# Altium schematic sheet V1_0.SchDoc
size A4
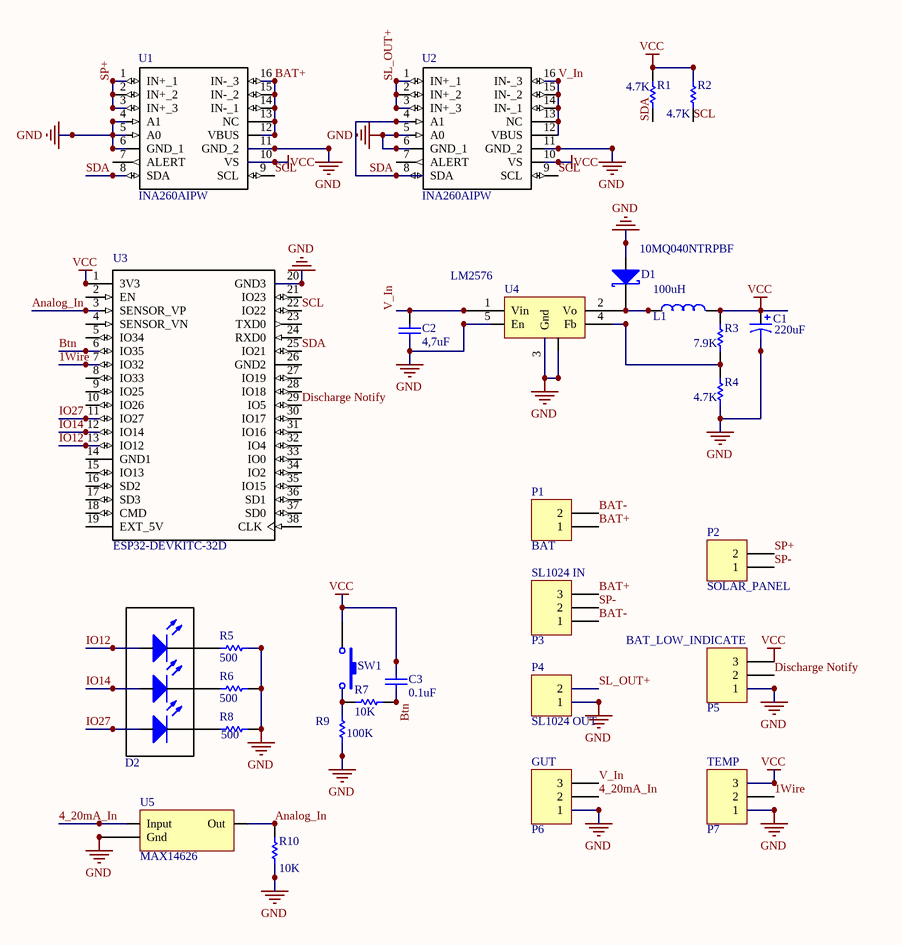
[diagram p0: V1_0.SchDoc]

## Parts
C1  value 220uF  [Capacitor -Tantalum E size SMD]  (hidden comment: Capacitor Tantalum)
C2  value 4,7uF  [CAPC3225L]  (hidden comment: Ceramic Capacitor)
C3  value 0.1uF  [CAP 0603]  (hidden comment: Capacitor)
D1  Name: 10MQ040NTRPBF  [DIOM4427X20N]  (hidden comment: Diode Schottky)
D2  RGB 5050  [LED 5050]  (value not drawn)
L1  value 100uH  [CDRH127]  (hidden comment: Coil)
P1  BAT  [DG301_2pin]
P2  SOLAR_PANEL  [DG301_2pin]
P3  SL1024 IN  [DG301_3pin]
P4  SL1024 OUT  [DG301_2pin]
P5  BAT_LOW_INDICATE  [DG301_3pin]
P6  GUT  [DG301_3pin]
P7  TEMP  [DG301_3pin]
R1  value 4.7K  [RES1608]
R2  value 4.7K  [RES1608]
R3  value 7.9K  [RES1608]
R4  value 4.7K  [RES1608]
R5  value 500  [RES1608]
R6  value 500  [RES1608]
R7  value 10K  [RES1608]
R8  value 500  [RES1608]
R9  value 100K  [RES1608]
R10  value 10K  [RESC3216L]  (hidden comment: Resistor)
SW1  SW-34  [SW-34]  (value not drawn)
U1  INA260AIPW  [SOP65P640X120-16N]
U2  INA260AIPW  [SOP65P640X120-16N]
U3  ESP32-DEVKITC-32D  [*MODULE_ESP32-DEVKITC-32D]
U4  PartNumber: LM2576  [TO170P1435X450-6N - duplicate]  (hidden comment: IC)
U5  MAX14626  [TDFN-6]

## Nets
GND: C1.1 C2.1 D1.2(A) P4.1 P5.1 P6.1 P7.1 R4.1 R5.1 R6.1 R8.1 R9.2 R10.1 U1.4(A1) U1.5(A0) U1.6(GND_1) U1.11(GND_2) U2.5(A0) U2.6(GND_1) U2.11(GND_2) U3.20(GND3) U4.3(Gnd) U4.5(En) U4.6(Gnd) U5.2(NC) U5.3(NC) U5.4(NC) U5.5(Gnd) U5.7(NC)
VCC: C1.2 C3.2 L1.1 P5.3 P7.3 R1.2 R2.2 R3.2 SW1.1 U1.10(VS) U2.10(VS) U3.1(3V3)
1Wire: P7.2 U3.7(IO32)
4_20mA_In: P6.2 U5.1(Input)
Analog_In: R10.2 U3.3(SENSOR_VP) U5.6(Out)
BAT+: P1.1 P3.3 U1.12(VBUS) U1.13(NC) U1.14(IN-_1) U1.15(IN-_2) U1.16(IN-_3)
BAT-: P1.2 P3.1
Btn: C3.1 R7.2 U3.6(IO35)
Discharge Notify: P5.2 U3.29(IO5)
IO12: D2.1 U3.13(IO12)
IO14: D2.2 U3.12(IO14)
IO27: D2.3 U3.11(IO27)
SCL: R2.1 U1.9(SCL) U2.9(SCL) U3.22(IO22)
SDA: R1.1 U1.8(SDA) U2.4(A1) U2.8(SDA) U3.25(IO21)
SL_OUT+: P4.2 U2.1(IN+_1) U2.2(IN+_2) U2.3(IN+_3)
SP+: P2.2 U1.1(IN+_1) U1.2(IN+_2) U1.3(IN+_3)
SP-: P2.1 P3.2
V_In: C2.2 P6.3 U2.12(VBUS) U2.13(NC) U2.14(IN-_1) U2.15(IN-_2) U2.16(IN-_3) U4.1(Vin)
NetD1_1: D1.1(K) L1.2 U4.2(Vo)
NetD2_4: D2.4 R5.2
NetD2_5: D2.5 R6.2
NetD2_6: D2.6 R8.2
NetR3_1: R3.1 R4.2 U4.4(Fb)
NetR7_1: R7.1 R9.1 SW1.2

Not connected (* = marked no-connect by the designer): U1 7(ALERT); U2 7(ALERT); U3 2(EN) 4(SENSOR_VN) 5(IO34) 8(IO33) 9(IO25) 10(IO26) 14(GND1) 15(IO13) 16(SD2) 17(SD3) 18(CMD) 19(EXT_5V) 21(IO23) 23(TXD0) 24(RXD0) 26(GND2) 27(IO19) 28(IO18) 30(IO17) 31(IO16) 32(IO4) 33(IO0) 34(IO2) 35(IO15) 36(SD1) 37(SD0) 38(CLK)

## Library data of the parts
C1 = Cap_tantal: Power/Voltage: 10V; Tolerance: +-10%; PackageDescription: SMD; PackageReference: Size-E
C2 = Cap Semi: Capacitor (Semiconductor SIM Model); Power/Voltage: 50V; Tolerance: +-10%; Published: 8-Jun-2000; LatestRevisionDate: 29-May-2009; LatestRevisionNote: IPC-7351 Footprint Added.; PackageReference: C1210; Publisher: Altium Limited; PackageDescription: SMD
D1 = Shotky_Diode: Manufacturer: International Rectifier; PackageDescription: SMA (DO-214AC); PartNumber: 10MQ040NTRPBF
L1 = Coil: Inductor; PartNumber: CDRH127/LD; Manufacturer: Sumida; Tolerance: +-20%
P1 P2 P4 = 2_pin: DG301
P3 P5-P7 = 3_PIN: DG301
R1-R9 = Res Semi: Semiconductor Resistor; Published: 8-Jun-2000; LatestRevisionDate: 17-Jul-2002; LatestRevisionNote: Re-released for DXP Platform.; PackageReference: AXIAL-0.5; Publisher: Altium Limited
R10 = Res Semi: Semiconductor Resistor; Power/Voltage: 0.25W; Tolerance: +-5%; Published: 8-Jun-2000; LatestRevisionDate: 17-Jul-2002; LatestRevisionNote: Re-released for DXP Platform.; PackageReference: R1206; Publisher: Altium Limited; PackageDescription: SMD
U1 U2 = INA260AIPW: Integrated Circuit; Manufacturer_Name: Texas Instruments; Datasheet Link: http://www.ti.com/lit/gpn/ina260; Height: 1.2mm; Manufacturer_Part_Number: INA260AIPW; Mouser Part Number: 595-INA260AIPW; Mouser Price/Stock: https://www.mouser.com/Search/Refine.aspx?Keyword=595-INA260AIPW
U3 = ESP32-DEVKITC-32D: Eval Board For Esp-Wroom-32; MF: Espressif Systems; Price: None; MP: ESP32-DEVKITC-32D; SnapEDA_Link: https://www.snapeda.com/parts/ESP32-DEVKITC-32D/Espressif%20Systems/view-part/?ref=snap; Package: None; Availability: Unavailable; Value: *
U4 = LM2575: Manufacturer: TEXAS INSTRUMENTS; PackageDescription: TO-263-5
U5 = MAX14626: 4–20mA  Current Loop Protector